# Altium schematic sheet Tape.SchDoc
size A4; SheetNumber: 4; SheetTotal: 15
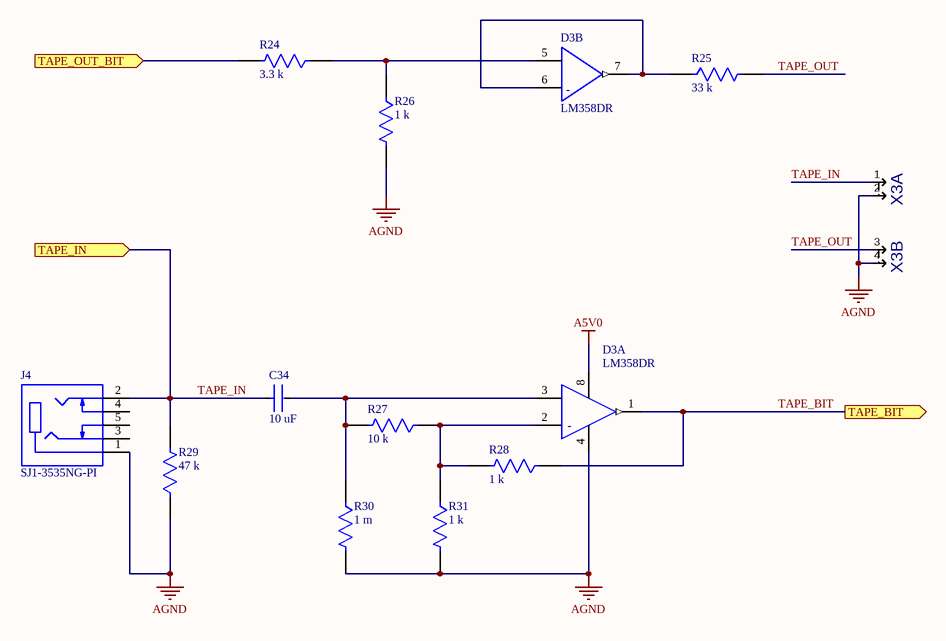
[diagram p0: Tape.SchDoc]

## Parts
C34  Capacitance: 10 uF  [CC0805]  (hidden comment: CC0805-1.5pF)
D3  LM358DR  [FP-D0008A-MFG]  (parts A,B of 2)
J4  SJ1-3535NG-PI  [CUI_SJ1-3535NG-PI]
R24  Resistance: 3.3 k  [CR0805]  (hidden comment: CR0805-51)
R25  Resistance: 33 k  [CR0805]  (hidden comment: CR0805-51)
R26  Resistance: 1 k  [CR0805]  (hidden comment: CR0805-51)
R27  Resistance: 10 k  [CR0805]  (hidden comment: CR0805-51)
R28  Resistance: 1 k  [CR0805]  (hidden comment: CR0805-51)
R29  Resistance: 47 k  [CR0805]  (hidden comment: CR0805-51)
R30  Resistance: 1 m  [CR0805]  (hidden comment: CR0805-51)
R31  Resistance: 1 k  [CR0805]  (hidden comment: CR0805-51)
X3  PLB2-2  [PLB2-2]  (value not drawn)  (parts A,B of 2)

## Ports
TAPE_BIT (out), TAPE_IN (in), TAPE_OUT_BIT (in)

## Nets
A5V0: D3.8(V+)
AGND: D3.4(V-) J4.1 R26.2 R29.1 R30.2 R31.2 X3.2 X3.4
TAPE_BIT: D3.1(1OUT) R28.1 ; port TAPE_BIT
TAPE_IN: C34.1 J4.2 R29.2 X3.1 ; port TAPE_IN
TAPE_OUT: R25.2 X3.3
TAPE_OUT_BIT: R24.2 ; port TAPE_OUT_BIT
NetC34_2: C34.2 D3.3(IN1+) R27.2 R30.1
NetD3_2: D3.2(IN1-) R27.1 R28.2 R31.1
NetD3_5: D3.5(IN2+) R24.1 R26.1
NetD3_6: D3.6(IN2-) D3.7(2OUT) R25.1

Not connected (* = marked no-connect by the designer): J4 3 4 5

## Notes on the sheet
- (in symbol LM358DR, part A) -
- (in symbol LM358DR, part B) -

## Library data of the parts
C34 = CC0805: CL21 Series 0805 1.5pF 50V ±0.25pF Tolerance C0G Multilayer Ceramic Chip Capacitor; Manufacturer Part Number: CL21C1R5CBANNNC; Manufacturer: Samsung; value: 1.5pF; Category: Cap; Case/Package: 0805
D3 = LM358DR: IC OPAMP GP 2 CIRCUIT 8SOIC; Manufacturer: Texas Instruments; Case/Package: SOIC; Number of Pins: 8; Manufacturer Part Number: LM358DR; value: LM358DR; Category: IC
J4 = SJ1-3535NG-PI: 3.5 mm Right-Angle Stereo Jack, 5 pin PCB PCB Mount, Isolated Ground, Pink; MF: {'manufacturer': u'CUI'}; Value: *; MP: SJ1-3535NG-PI; Availability: Unavailable; Price: None; Package: None
R24 = CR0805: 51Ω ±0.5% 0.1W 1/10W Chip Resistor 0805 (2012 Metric) Thin Film; Manufacturer Part Number: RR1220Q-510-D; Manufacturer: Susumu; value: 51Ω; Category: Res; Case/Package: 0805; Number of Terminations: 2; Termination: SMD/SMT; Number of Pins: 2
R25-R31 = CR0805: 51Ω ±0.5% 0.1W 1/10W Chip Resistor 0805 (2012 Metric) Thin Film; Manufacturer: Susumu; Manufacturer Part Number: RR1220Q-510-D; Number of Terminations: 2; Case/Package: 0805; value: 51Ω; Category: Res; Termination: SMD/SMT; Number of Pins: 2
X3 = PLB2-2: Value: PLD-4; Case/Package: PLD-4; Category: Connector